# Altium schematic sheet Sheet2.SchDoc: =Name-1str
size 594 x 420 mm; SheetNumber: номер страницы; Вид изделия: Документация; Раздел: Документация; Код документа: Э3; Вид документа: Схема электрическая принципиальная; Класс документа: Конструкторский документ; Создавать изделие в PLM: Yes; DocumentCode: Э3; DocumentView: Схема электрическая принципиальная; DocumentClass: Конструкторский документ; ProductView: Документация
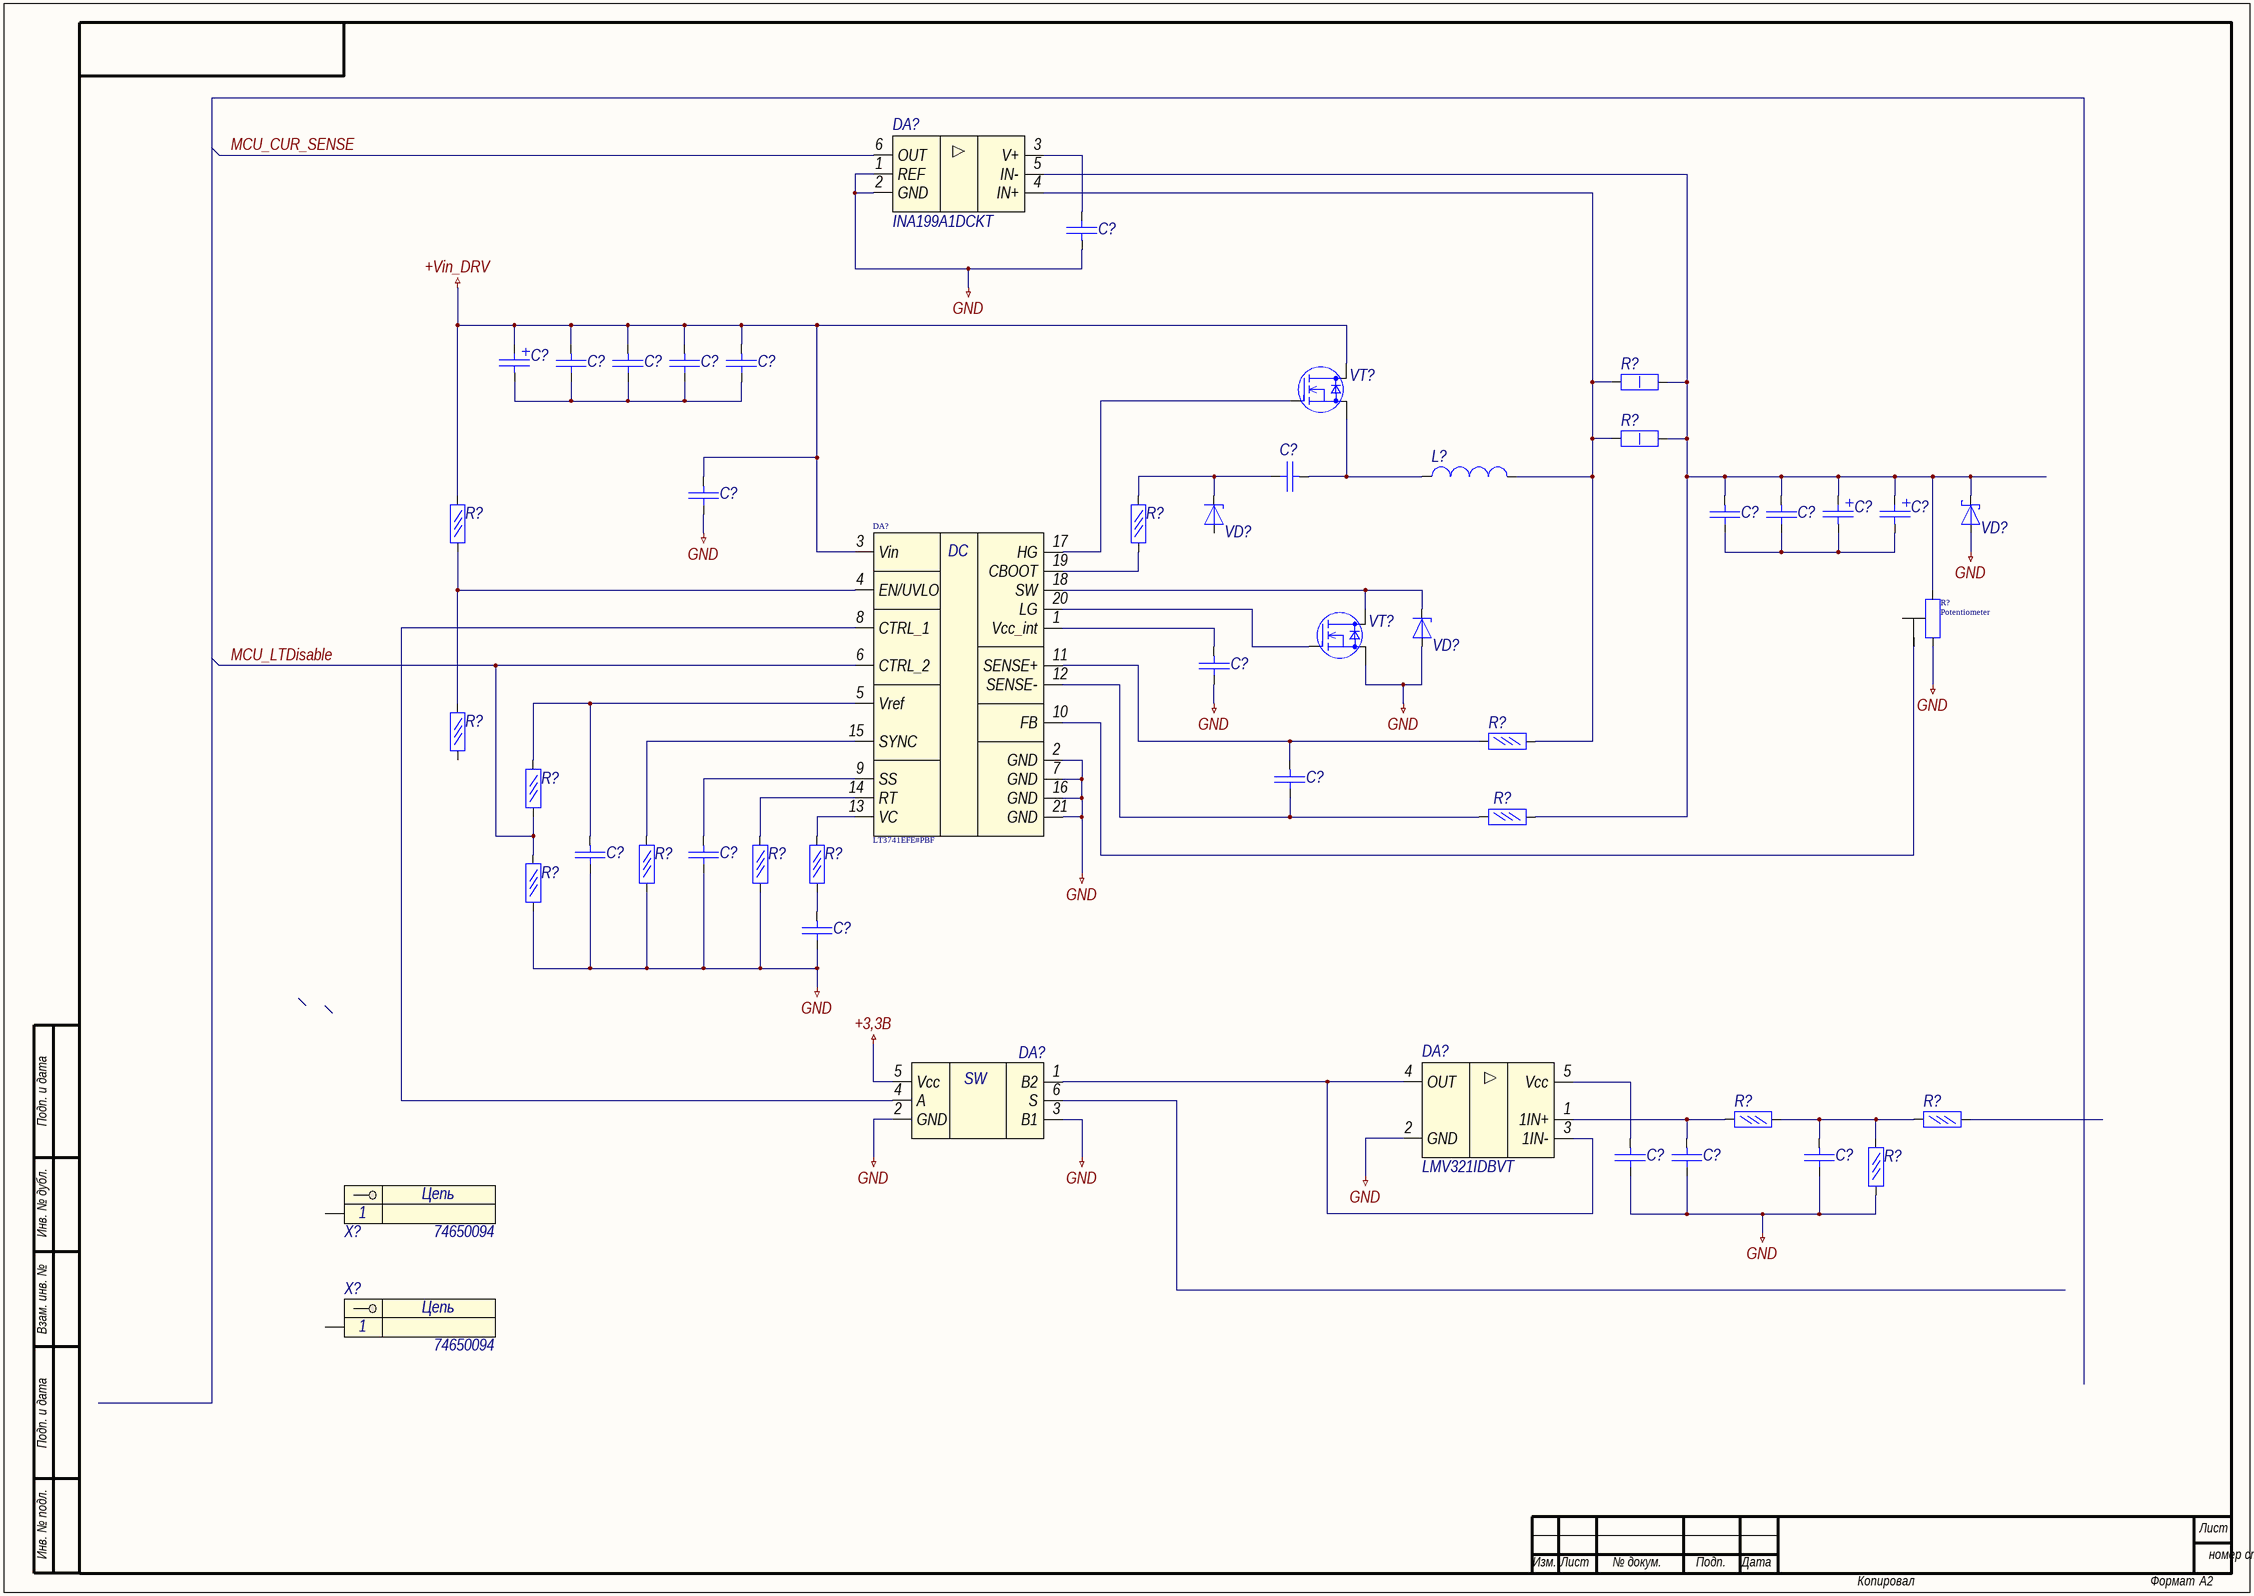
[diagram p0: Sheet2.SchDoc]

## Parts
(Parts that share a designator on the sheet are numbered #1, #2 ... from top to bottom, then left to right.)
C?#1  (no value)  [C0805_AA]
C?#2  (no value)  [C0805_AA]
C?#3  (no value)  [C0805_AA]
C?#4  (no value)  [C0805_AA]
C?#5  (no value)  [C0805_AA]
C?#6  (no value)  [C0805_AA]
C?#7  (no value)  [C0805_AA]
C?#8  (no value)  [C0805_AA]
C?#9  (no value)  [C0805_AA]
C?#10  (no value)  [C0805_AA]
C?#11  (no value)  [C0805_AA]
C?#12  (no value)  [C0805_AA]
C?#13  (no value)  [C0805_AA]
C?#14  (no value)  [C0805_AA]
C?#15  (no value)  [C0805_AA]
C?#16  (no value)  [C0805_AA]
C?#17  (no value)  [C0805_AA]
C?#18  (no value)  [C0805_AA]
C?#19  (no value)  [C0805_AA]
C?#20  (no value)  [C0805_AA]
DA?#1  INA199A1DCKT
DA?#2  LT3741EFE#PBF
DA?#3  SN74LVC1G3157  (value not drawn)
DA?#4  LMV321IDBVT
L?  (no value)  [L0603_A]
R?#1  (no value)  [R1206]
R?#2  (no value)  [R1206]
R?#3  (no value)  [R1206]
R?#4  (no value)  [R1206]
R?#5  Potentiometer
R?#6  (no value)  [R1206]
R?#7  (no value)  [R1206]
R?#8  (no value)  [R1206]
R?#9  (no value)  [R1206]
R?#10  (no value)  [R1206]
R?#11  (no value)  [R1206]
R?#12  (no value)  [R1206]
R?#13  (no value)  [R1206]
R?#14  (no value)  [R1206]
R?#15  (no value)  [R1206]
R?#16  (no value)  [R1206]
VD?#1  (no value)  [SOT23-2_A]
VD?#2  (no value)  [SOD123_A]
VD?#3  (no value)  [SOT23-2_A]
VT?#1  (no value)  [КТ-111В-1.02]
VT?#2  (no value)  [КТ-111В-1.02]
X?#1  74650094
X?#2  74650094

## Nets
+3,3В: DA?#3.5(Vcc)
+Vin_DRV: C?#2.1 C?#3.2 C?#4.2 C?#5.2 C?#6.2 C?#10.2 DA?#2.3(Vin) R?#3.2 VT?#1.3(D)
GND: C?#1.2 C?#10.1 C?#13.1 C?#15.1 C?#16.1 C?#17.1 C?#18.1 C?#19.1 C?#20.1 DA?#1.1(REF) DA?#1.2(GND) DA?#2.2(GND) DA?#2.7(GND) DA?#2.16(GND) DA?#2.21(GND) DA?#3.2(GND) DA?#3.3(B1) DA?#4.2(GND) R?#5.3 R?#10.1 R?#11.1 R?#13.1 R?#16.1 VD?#2.2(A) VD?#3.2(A) VT?#2.2(S)
MCU_CUR_SENSE: DA?#1.6(OUT)
MCU_LTDisable: DA?#2.6(CTRL_2) R?#8.1 R?#13.2
NetC?#1_1: C?#1.1 DA?#1.3(V+)
NetC?#2_2: C?#2.2 C?#3.1 C?#4.1 C?#5.1 C?#6.1
NetC?#7_1: C?#7.1 R?#4.2 VD?#1.1(K)
NetC?#7_2: C?#7.2 L?.1 VT?#1.2(S)
NetC?#8_1: C?#8.1 C?#9.1 C?#11.2 C?#12.2 DA?#1.5(IN-) R?#1.2 R?#2.2 R?#5.1 R?#9.2 VD?#2.1(K)
NetC?#8_2: C?#8.2 C?#9.2 C?#11.1 C?#12.1
NetC?#13_2: C?#13.2 DA?#2.1(Vcc_int)
NetC?#14_1: C?#14.1 DA?#2.12(SENSE-) R?#9.1
NetC?#14_2: C?#14.2 DA?#2.11(SENSE+) R?#6.1
NetC?#15_2: C?#15.2 DA?#2.5(Vref) R?#8.2
NetC?#16_2: C?#16.2 DA?#2.9(SS)
NetC?#17_2: C?#17.2 R?#12.1
NetC?#18_2: C?#18.2 DA?#4.5(Vcc)
NetC?#19_2: C?#19.2 DA?#4.1(1IN+) R?#14.2
NetC?#20_2: C?#20.2 R?#14.1 R?#15.2 R?#16.2
NetDA?#1_4: DA?#1.4(IN+) L?.2 R?#1.1 R?#2.1 R?#6.2
NetDA?#2_4: DA?#2.4(EN/UVLO) R?#3.1 R?#7.2
NetDA?#2_8: DA?#2.8(CTRL_1) DA?#3.4(A)
NetDA?#2_10: DA?#2.10(FB) R?#5.2
NetDA?#2_13: DA?#2.13(VC) R?#12.2
NetDA?#2_14: DA?#2.14(RT) R?#11.2
NetDA?#2_15: DA?#2.15(SYNC) R?#10.2
NetDA?#2_17: DA?#2.17(HG) VT?#1.1(G)
NetDA?#2_18: DA?#2.18(SW) VD?#3.1(K) VT?#2.3(D)
NetDA?#2_19: DA?#2.19(CBOOT) R?#4.1
NetDA?#2_20: DA?#2.20(LG) VT?#2.1(G)
NetDA?#3_1: DA?#3.1(B2) DA?#4.3(1IN-) DA?#4.4(OUT)

Not connected (* = marked no-connect by the designer): DA?#3 6(S); R?#7 1; R?#15 1; VD?#1 2(A); X?#1 1; X?#2 1

## Notes on the sheet
- Подп. и дата
- Инв. № дубл.
- Взам. инв. №
- Инв. № подл.
- Лист
- Изм.
- № докум.
- Подп.
- Дата
- Копировал
- Формат
- А2
- (in symbol LT3741) DC
- (in symbol SN74LVC1G3157) SW
- (in symbol x1-k) Цепь

## Library data of the parts
C?#1 C?#3-C?#7 C?#10-C?#20 = Конденсатор кер.
C?#2 C?#8 C?#9 = Конденсатор поляризованный: Конденсатор пол.
DA?#1 = INA199: Voltage output current shunt monitor
DA?#2 = LT3741: Step-Down Controller, Constant Voltage
DA?#3 = SN74LVC1G3157: Аналоговый переключатель, двухпозиционный
DA?#4 = LMV321: Операционный усилитель Rail-to-rail
L? = Inductor: Катушка индуктивности
R?#1 R?#2 = Резистор  1Вт: Power rating: 1Вт
R?#3 R?#4 R?#6-R?#16 = Резистор  0,05Вт: Резистор 0,05Вт; Power rating: 0,05Вт
VD?#1 VD?#3 = DiodeZener: Стабилитрон
VD?#2 = DiodeSchottky: Диод Шоттки
VT?#1 VT?#2 = N-Mosfet: N-канальный транзистор; Vgs: *; Rds: *; Vds: *
X?#1 X?#2 = x1-k: Разъем - 1 конт. клемма; Name: 74650094